# EAGLE design alphanewt_v1.7 (EAGLE 8.4.1)
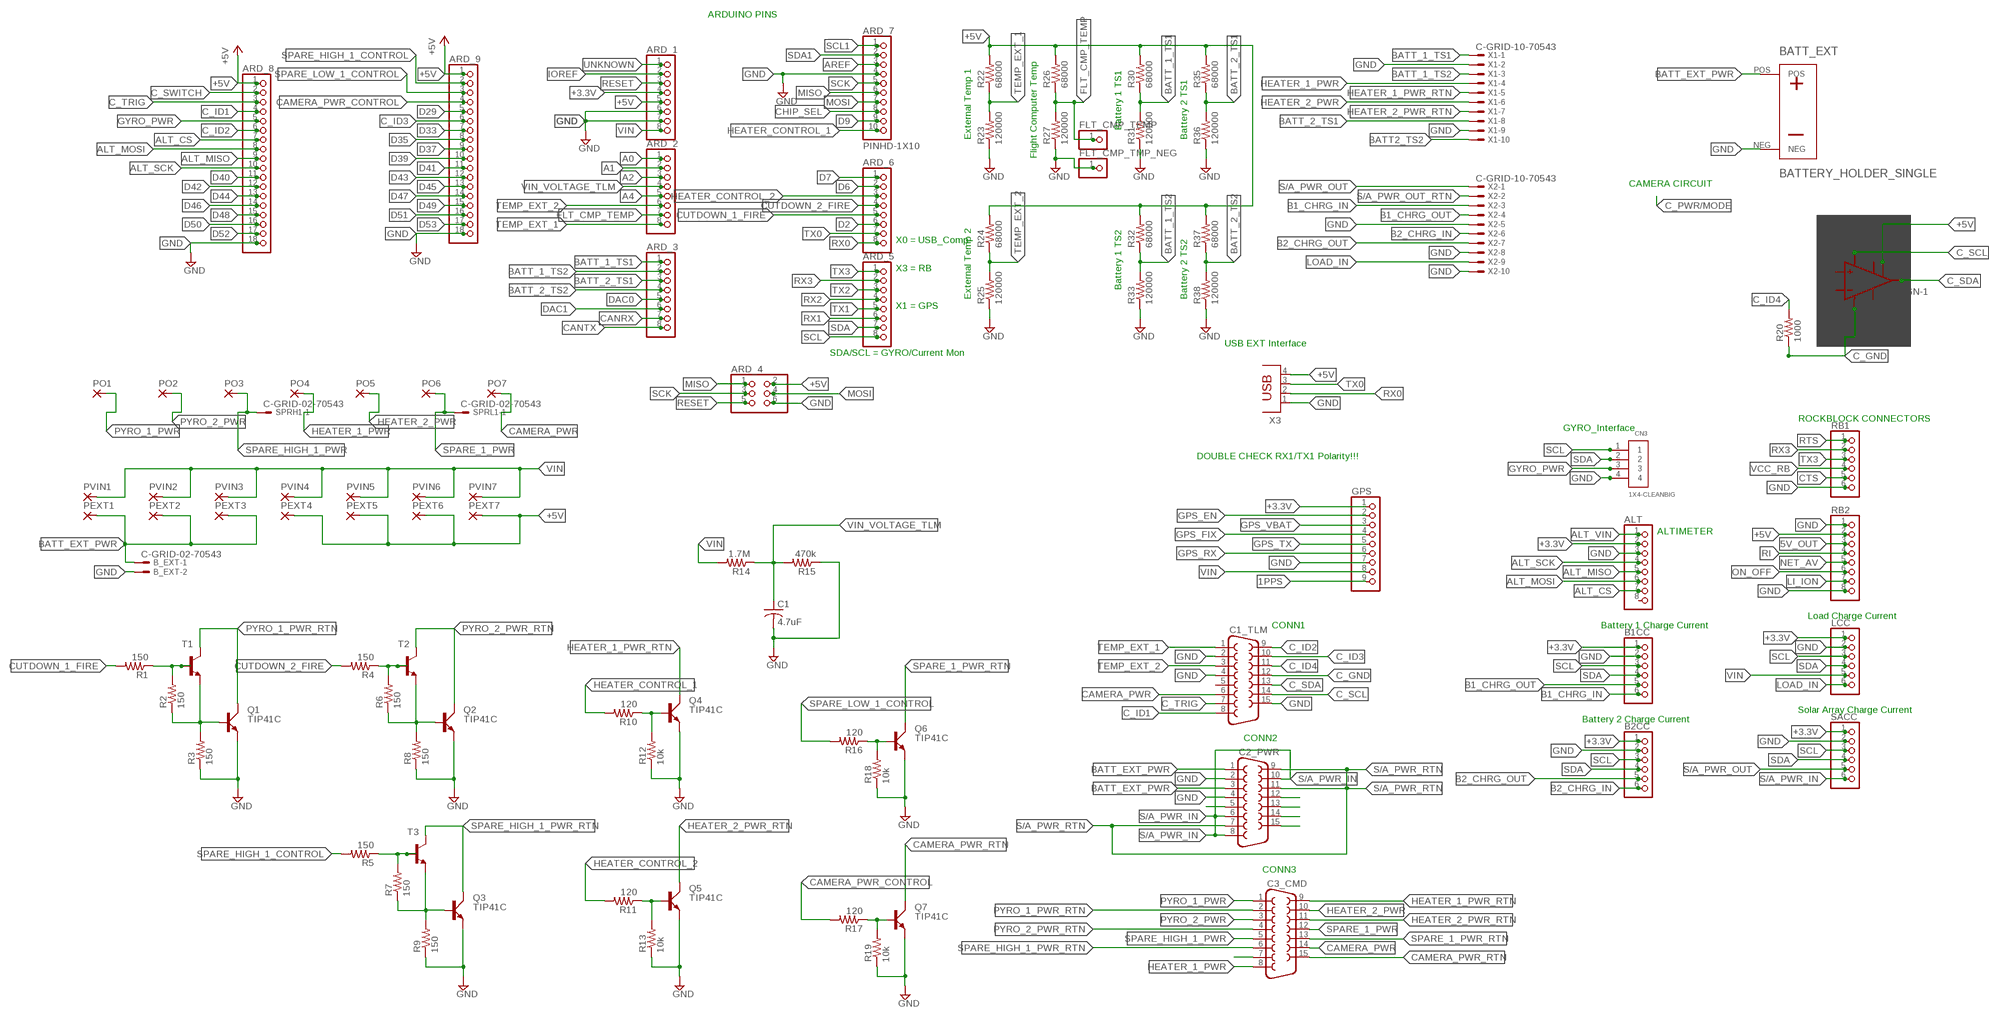
[diagram p0: schematic, sheet 1]

## Parts
ALT  PINHD-1X8BIG  [1X08-BIG]
ARD_1  PINHD-1X8BIG  [1X08-BIG]
ARD_2  PINHD-1X8BIG  [1X08-BIG]
ARD_3  PINHD-1X8BIG  [1X08-BIG]
ARD_4  PINHD-2X3  [2X03]
ARD_5  PINHD-1X8BIG  [1X08-BIG]
ARD_6  PINHD-1X8BIG  [1X08-BIG]
ARD_7  PINHD-1X10  [1X10-BIG]
ARD_8  PINHD-1X18-BIG  [1X18-BIG]
ARD_9  PINHD-1X18-BIG  [1X18-BIG]
B1CC  PINHD-1X6B  [1X06-BIG]
B2CC  PINHD-1X6B  [1X06-BIG]
B_EXT  C-GRID-02-70543  [70543-02]
BATT_EXT  BATTERY_HOLDER_SINGLE  [BATT_HOLDER_SINGLE]
C1  4.7uF  C-USC0805K  [C0805K]
C1_TLM  F15HP  [F15HP]
C2_PWR  F15HP  [F15HP]
C3_CMD  F15HP  [F15HP]
CN3  1X4-CLEANBIG  [1X04-CLEANBIG]
FLT_CMP_TEMP  PINHD-1X1  [1X01]
FLT_CMP_TMP_NEG  PINHD-1X1  [1X01]
GPS  PINHD-1X9  [1X09-BIG]
IC1  LM386N-1  [DIL08]
LCC  PINHD-1X6B  [1X06-BIG]
PEXT1  SMD2  [SMD1,27-2,54]
PEXT2  SMD2  [SMD1,27-2,54]
PEXT3  SMD2  [SMD1,27-2,54]
PEXT4  SMD2  [SMD1,27-2,54]
PEXT5  SMD2  [SMD1,27-2,54]
PEXT6  SMD2  [SMD1,27-2,54]
PEXT7  SMD2  [SMD1,27-2,54]
PO1  SMD2  [SMD1,27-2,54]
PO2  SMD2  [SMD1,27-2,54]
PO3  SMD2  [SMD1,27-2,54]
PO4  SMD2  [SMD1,27-2,54]
PO5  SMD2  [SMD1,27-2,54]
PO6  SMD2  [SMD1,27-2,54]
PO7  SMD2  [SMD1,27-2,54]
PVIN1  SMD2  [SMD1,27-2,54]
PVIN2  SMD2  [SMD1,27-2,54]
PVIN3  SMD2  [SMD1,27-2,54]
PVIN4  SMD2  [SMD1,27-2,54]
PVIN5  SMD2  [SMD1,27-2,54]
PVIN6  SMD2  [SMD1,27-2,54]
PVIN7  SMD2  [SMD1,27-2,54]
Q1  TIP41C  [TO220AV]
Q2  TIP41C  [TO220AV]
Q3  TIP41C  [TO220AV]
Q4  TIP41C  [TO220AV]
Q5  TIP41C  [TO220AV]
Q6  TIP41C  [TO220AV]
Q7  TIP41C  [TO220AV]
R1  150  R-US_R0805  [R0805]
R2  150  R-US_R0805  [R0805]
R3  150  R-US_R0805  [R0805]
R4  150  R-US_R0805  [R0805]
R5  150  R-US_R0805  [R0805]
R6  150  R-US_R0805  [R0805]
R7  150  R-US_R0805  [R0805]
R8  150  R-US_R0805  [R0805]
R9  150  R-US_R0805  [R0805]
R10  120  R-US_R0805  [R0805]
R11  120  R-US_R0805  [R0805]
R12  10k  R-US_R0805  [R0805]
R13  10k  R-US_R0805  [R0805]
R14  1.7M  R-US_R0805  [R0805]
R15  470k  R-US_R0805  [R0805]
R16  120  R-US_R0805  [R0805]
R17  120  R-US_R0805  [R0805]
R18  10k  R-US_R0805  [R0805]
R19  10k  R-US_R0805  [R0805]
R20  1000  R-US_R0805  [R0805]
R22  68000  R-US_R0805  [R0805]
R23  120000  R-US_R0805  [R0805]
R24  68000  R-US_R0805  [R0805]
R25  120000  R-US_R0805  [R0805]
R26  68000  R-US_R0805  [R0805]
R27  120000  R-US_R0805  [R0805]
R30  68000  R-US_R0805  [R0805]
R31  120000  R-US_R0805  [R0805]
R32  68000  R-US_R0805  [R0805]
R33  120000  R-US_R0805  [R0805]
R35  68000  R-US_R0805  [R0805]
R36  120000  R-US_R0805  [R0805]
R37  68000  R-US_R0805  [R0805]
R38  120000  R-US_R0805  [R0805]
RB1  PINHD-1X6CB  [1X06-CLEANBIG]
RB2  PINHD-1X8BIG  [1X08-BIG]
SACC  PINHD-1X6B  [1X06-BIG]
SPRH1  C-GRID-02-70543  [70543-02]
SPRL1  C-GRID-02-70543  [70543-02]
T1  2N3904  [TO92]
T2  2N3904  [TO92]
T3  2N3904  [TO92]
X1  C-GRID-10-70543  [70543-10]
X2  C-GRID-10-70543  [70543-10]
X3  PN87520  [PN87520]

## Nets
1PPS: GPS.9
5V_OUT: RB2.3
+3.3V: ALT.2 ARD_1.4 B1CC.1 B2CC.1 GPS.1 LCC.1 SACC.1
+5V [PWR]: ARD_1.5 ARD_4.2 ARD_8.1 ARD_9.1 IC1.8(GAIN) PEXT4.1(P) PEXT5.1(P) PEXT6.1(P) PEXT7.1(P) R22.2 R24.2 R26.2 R30.2 R32.2 R35.2 R37.2 RB2.2 X3.4
A0: ARD_2.1
A1: ARD_2.2
A2: ARD_2.3
A4: ARD_2.5
ALT_CS: ALT.7 ARD_8.7
ALT_MISO: ALT.5 ARD_8.9
ALT_MOSI: ALT.6 ARD_8.8
ALT_SCK: ALT.4 ARD_8.10
ALT_VIN: ALT.1
AREF: ARD_7.3
B1_CHRG_IN [PWR]: B1CC.6 X2.3
B1_CHRG_OUT [PWR]: B1CC.5 X2.4
B2_CHRG_IN [PWR]: B2CC.6 X2.6
B2_CHRG_OUT [PWR]: B2CC.5 X2.7
BATT2_TS2: X1.10
BATT_1_TS1: ARD_3.1 R30.1 R31.2 X1.1
BATT_1_TS2: ARD_3.2 R32.1 R33.2 X1.3
BATT_2_TS1: ARD_3.3 R35.1 R36.2 X1.8
BATT_2_TS2: ARD_3.4 R37.1 R38.2
BATT_EXT_PWR [PWR]: B_EXT.1 BATT_EXT.POS C2_PWR.1 C2_PWR.3 PEXT1.1(P) PEXT2.1(P) PEXT3.1(P)
C_GND: C1_TLM.12 IC1.4(GND) R20.1
C_ID1: ARD_8.4 C1_TLM.8
C_ID2: ARD_8.6 C1_TLM.9
C_ID3: ARD_9.6 C1_TLM.10
C_ID4: C1_TLM.11 R20.2
C_SCL: C1_TLM.14 IC1.6(VS)
C_SDA: C1_TLM.13 IC1.5(OUT)
C_SWITCH: ARD_8.2
C_TRIG: ARD_8.3 C1_TLM.7
CAMERA_PWR [PWR]: C1_TLM.6 C3_CMD.14 PO7.1(P)
CAMERA_PWR_CONTROL: ARD_9.4 R17.2
CAMERA_PWR_RTN [PWR]: C3_CMD.15 Q7.C
CANRX: ARD_3.7
CANTX: ARD_3.8
CHIP_SEL: ARD_7.8
CTS: RB1.5
CUTDOWN_1_FIRE: ARD_6.5 R1.2
CUTDOWN_2_FIRE: ARD_6.4 R4.2
D2: ARD_6.6
D6: ARD_6.2
D7: ARD_6.1
D9: ARD_7.9
D29: ARD_9.5
D33: ARD_9.7
D35: ARD_9.8
D37: ARD_9.9
D39: ARD_9.10
D40: ARD_8.11
D41: ARD_9.11
D42: ARD_8.12
D43: ARD_9.12
D44: ARD_8.13
D45: ARD_9.13
D46: ARD_8.14
D47: ARD_9.14
D48: ARD_8.15
D49: ARD_9.15
D50: ARD_8.16
D51: ARD_9.16
D52: ARD_8.17
D53: ARD_9.17
DAC0: ARD_3.5
DAC1: ARD_3.6
FLT_CMP_TEMP: ARD_2.7 FLT_CMP_TEMP.1 R26.1 R27.2
GND: ALT.3 ARD_1.6 ARD_1.7 ARD_4.6 ARD_7.4 ARD_8.18 ARD_9.18 B1CC.2 B2CC.2 B_EXT.2 BATT_EXT.NEG C1.2 C1_TLM.2 C1_TLM.4 C1_TLM.15 C2_PWR.2 C2_PWR.4 CN3.4 FLT_CMP_TMP_NEG.1 GPS.7 LCC.2 Q1.E Q2.E Q3.E Q4.E Q5.E Q6.E Q7.E R3.1 R8.1 R9.1 R12.1 R13.1 R15.1 R18.1 R19.1 R23.1 R25.1 R27.1 R31.1 R33.1 R36.1 R38.1 RB1.6 RB2.1 RB2.8 SACC.2 X1.2 X1.9 X2.5 X2.8 X2.10 X3.1
GPS_EN: GPS.2
GPS_FIX: GPS.4
GPS_RX: GPS.6
GPS_TX: GPS.5
GPS_VBAT: GPS.3
GYRO_PWR: ARD_8.5 CN3.3
HEATER_1_PWR [PWR]: C3_CMD.8 PO4.1(P) X1.4
HEATER_1_PWR_RTN [PWR]: C3_CMD.9 Q4.C X1.5
HEATER_2_PWR [PWR]: C3_CMD.10 PO5.1(P) X1.6
HEATER_2_PWR_RTN [PWR]: C3_CMD.11 Q5.C X1.7
HEATER_CONTROL_1: ARD_7.10 R10.2
HEATER_CONTROL_2: ARD_6.3 R11.2
IOREF: ARD_1.2
LI_ION: RB2.7
LOAD_IN [PWR]: LCC.6 X2.9
MISO: ARD_4.1 ARD_7.6
MOSI: ARD_4.4 ARD_7.7
N$15: R4.1 R6.2 T2.2(B)
N$16: R1.1 R2.2 T1.2(B)
N$18: Q4.B R10.1 R12.2
N$19: Q2.B R6.1 R8.2 T2.3(E)
N$22: Q5.B R11.1 R13.2
N$23: Q1.B R2.1 R3.2 T1.3(E)
N$24: Q6.B R16.1 R18.2
N$26: R5.1 R7.2 T3.2(B)
N$27: Q3.B R7.1 R9.2 T3.3(E)
N$31: Q7.B R17.1 R19.2
N$47: C2_PWR.12
N$48: C2_PWR.13
N$49: C2_PWR.14
N$50: C2_PWR.15
N$55: C2_PWR.5
N$72 [PWR]: C3_CMD.7
NET_AV: RB2.5
ON_OFF: RB2.6
PYRO_1_PWR [PWR]: C3_CMD.1 PO1.1(P)
PYRO_1_PWR_RTN [PWR]: C3_CMD.2 Q1.C T1.1(C)
PYRO_2_PWR [PWR]: C3_CMD.3 PO2.1(P)
PYRO_2_PWR_RTN [PWR]: C3_CMD.4 Q2.C T2.1(C)
RESET: ARD_1.3 ARD_4.5
RI: RB2.4
RTS: RB1.1
RX0: ARD_6.8 X3.2
RX1: ARD_5.6
RX2: ARD_5.4
RX3: ARD_5.2 RB1.2
S/A_PWR_IN [PWR]: C2_PWR.6 C2_PWR.8 C2_PWR.10 SACC.6
S/A_PWR_OUT [PWR]: SACC.5 X2.1
S/A_PWR_OUT_RTN: X2.2
S/A_PWR_RTN [PWR]: C2_PWR.7 C2_PWR.9 C2_PWR.11
SCK: ARD_4.3 ARD_7.5
SCL: ARD_5.8 B1CC.3 B2CC.3 CN3.1 LCC.3 SACC.3
SCL1: ARD_7.1
SDA: ARD_5.7 B1CC.4 B2CC.4 CN3.2 LCC.4 SACC.4
SDA1: ARD_7.2
SPARE_1_PWR [PWR]: C3_CMD.12 PO6.1(P) SPRL1.1
SPARE_1_PWR_RTN [PWR]: C3_CMD.13 Q6.C
SPARE_HIGH_1_CONTROL: ARD_9.2 R5.2
SPARE_HIGH_1_PWR [PWR]: C3_CMD.5 PO3.1(P) SPRH1.1
SPARE_HIGH_1_PWR_RTN [PWR]: C3_CMD.6 Q3.C T3.1(C)
SPARE_LOW_1_CONTROL: ARD_9.3 R16.2
TEMP_EXT_1: ARD_2.8 C1_TLM.1 R22.1 R23.2
TEMP_EXT_2: ARD_2.6 C1_TLM.3 R24.1 R25.2
TX0: ARD_6.7 X3.3
TX1: ARD_5.5
TX2: ARD_5.3
TX3: ARD_5.1 RB1.3
UNKNOWN: ARD_1.1
VCC_RB: RB1.4
VIN [PWR]: ARD_1.8 GPS.8 LCC.5 PVIN1.1(P) PVIN2.1(P) PVIN3.1(P) PVIN4.1(P) PVIN5.1(P) PVIN6.1(P) PVIN7.1(P) R14.2
VIN_VOLTAGE_TLM: ARD_2.4 C1.1 R14.1 R15.2
Unconnected: ALT.8 C1_TLM.5 IC1.1(GAIN) IC1.2(-IN) IC1.3(+IN) IC1.7(BYPASS) SPRH1.2 SPRL1.2

## Notes on the sheet
- ARDUINO PINS
- Battery 1 TS1
- External Temp 1 | Battery 2 TS1
- Flight Computer Temp
- CAMERA CIRCUIT
- X0 = USB_Comp
- X3 = RB
- Battery 1 TS2
- External Temp 2 | Battery 2 TS2
- X1 = GPS
- USB EXT Interface
- SDA/SCL = GYRO/Current Mon
- ROCKBLOCK CONNECTORS
- GYRO_Interface
- DOUBLE CHECK RX1/TX1 Polarity!!!
- ALTIMETER
- Load Charge Current
- CONN1 | Battery 1 Charge Current
- Solar Array Charge Current
- Battery 2 Charge Current
- CONN2
- CONN3

## Library data of the parts
ALT ARD_1-ARD_3 ARD_5 ARD_6 RB2 = adafruit:PINHD-1X8: PIN HEADER; OC_NEWARK: unknown
ARD_4 = pinhead:PINHD-2X3: PIN HEADER; OC_NEWARK: unknown
ARD_7 = adafruit:PINHD-1X10: Pin header 1x10 0.1" spacing With round pins; OC_NEWARK: unknown
ARD_8 ARD_9 = adafruit:PINHD-1X18: PIN HEADER; OC_NEWARK: unknown
B1CC B2CC LCC RB1 SACC = adafruit:PINHD-1X6: PIN HEADER; OC_NEWARK: unknown
B_EXT SPRH1 SPRL1 = con-molex:C-GRID-02: CONNECTOR wire to board 2.54 mm (0.100") pitch header; MF: MOLEX; MPN: 70543-0001; OC_FARNELL: unknown; OC_NEWARK: 59H2645
BATT_EXT = Battery_Holder_Single:BATTERY_HOLDER_SINGLE
C1 = adafruit:C-US: CAPACITOR, American symbol; MPN: C2012X6S1H475K125AC; OC_NEWARK: 95Y0059
C1_TLM C2_PWR C3_CMD = adafruit:F15: SUB-D HDH is also known as a 'right angle VGA' connector; MPN: 5504F1-15S-02A-03; OC_NEWARK: 18T0705
CN3 = adafruit:1X4: 4-pin connector
FLT_CMP_TEMP FLT_CMP_TMP_NEG = adafruit:PINHD-1X1: Pin header 1x1 for 0.1" spacing With round pins; OC_NEWARK: unknown
GPS = adafruit:PINHD-1X9: Pin header 1x10 0.1" spacing With round pins
IC1 = linear:LM386?-*: Low Voltage Audio Power Amplifier Source: http://cache.national.com/ds/LM/LM386.pdf
PEXT1-PEXT7 PO1-PO7 PVIN1-PVIN7 = wirepad:SMD2: SMD PAD; OC_NEWARK: unknown
Q1-Q7 = transistor-power:TIP41C: NPN TRANSISTOR; MF: FAIRCHILD SEMICONDUCTOR; MPN: TIP41C; OC_NEWARK: 58K2429
R1-R20 R22-R27 R30-R33 R35-R38 = adafruit:R-US_: RESISTOR, American symbol; MF: VISHAY/DALE; MPN: CRCW120633R2FKEA; OC_NEWARK: 42K4999
T1-T3 = transistor:2N3904: NPN TRANSISTOR; MF: NTE ELECTRONICS; MPN: 2N3904; OC_NEWARK: 33C8259
X1 X2 = con-molex:C-GRID-10: CONNECTOR wire to board 2.54 mm (0.100") pitch header; OC_FARNELL: unknown; OC_NEWARK: unknown
X3 = con-berg:PN87520: BERG USB connector; OC_FARNELL: unknown; OC_NEWARK: unknown

## Net classes
0 default: width 0.305 mm, drill 0.508 mm, clearance 0.254 mm
1 PWR: width 0.406 mm, drill 0.508 mm, clearance 0.305 mm

## Board
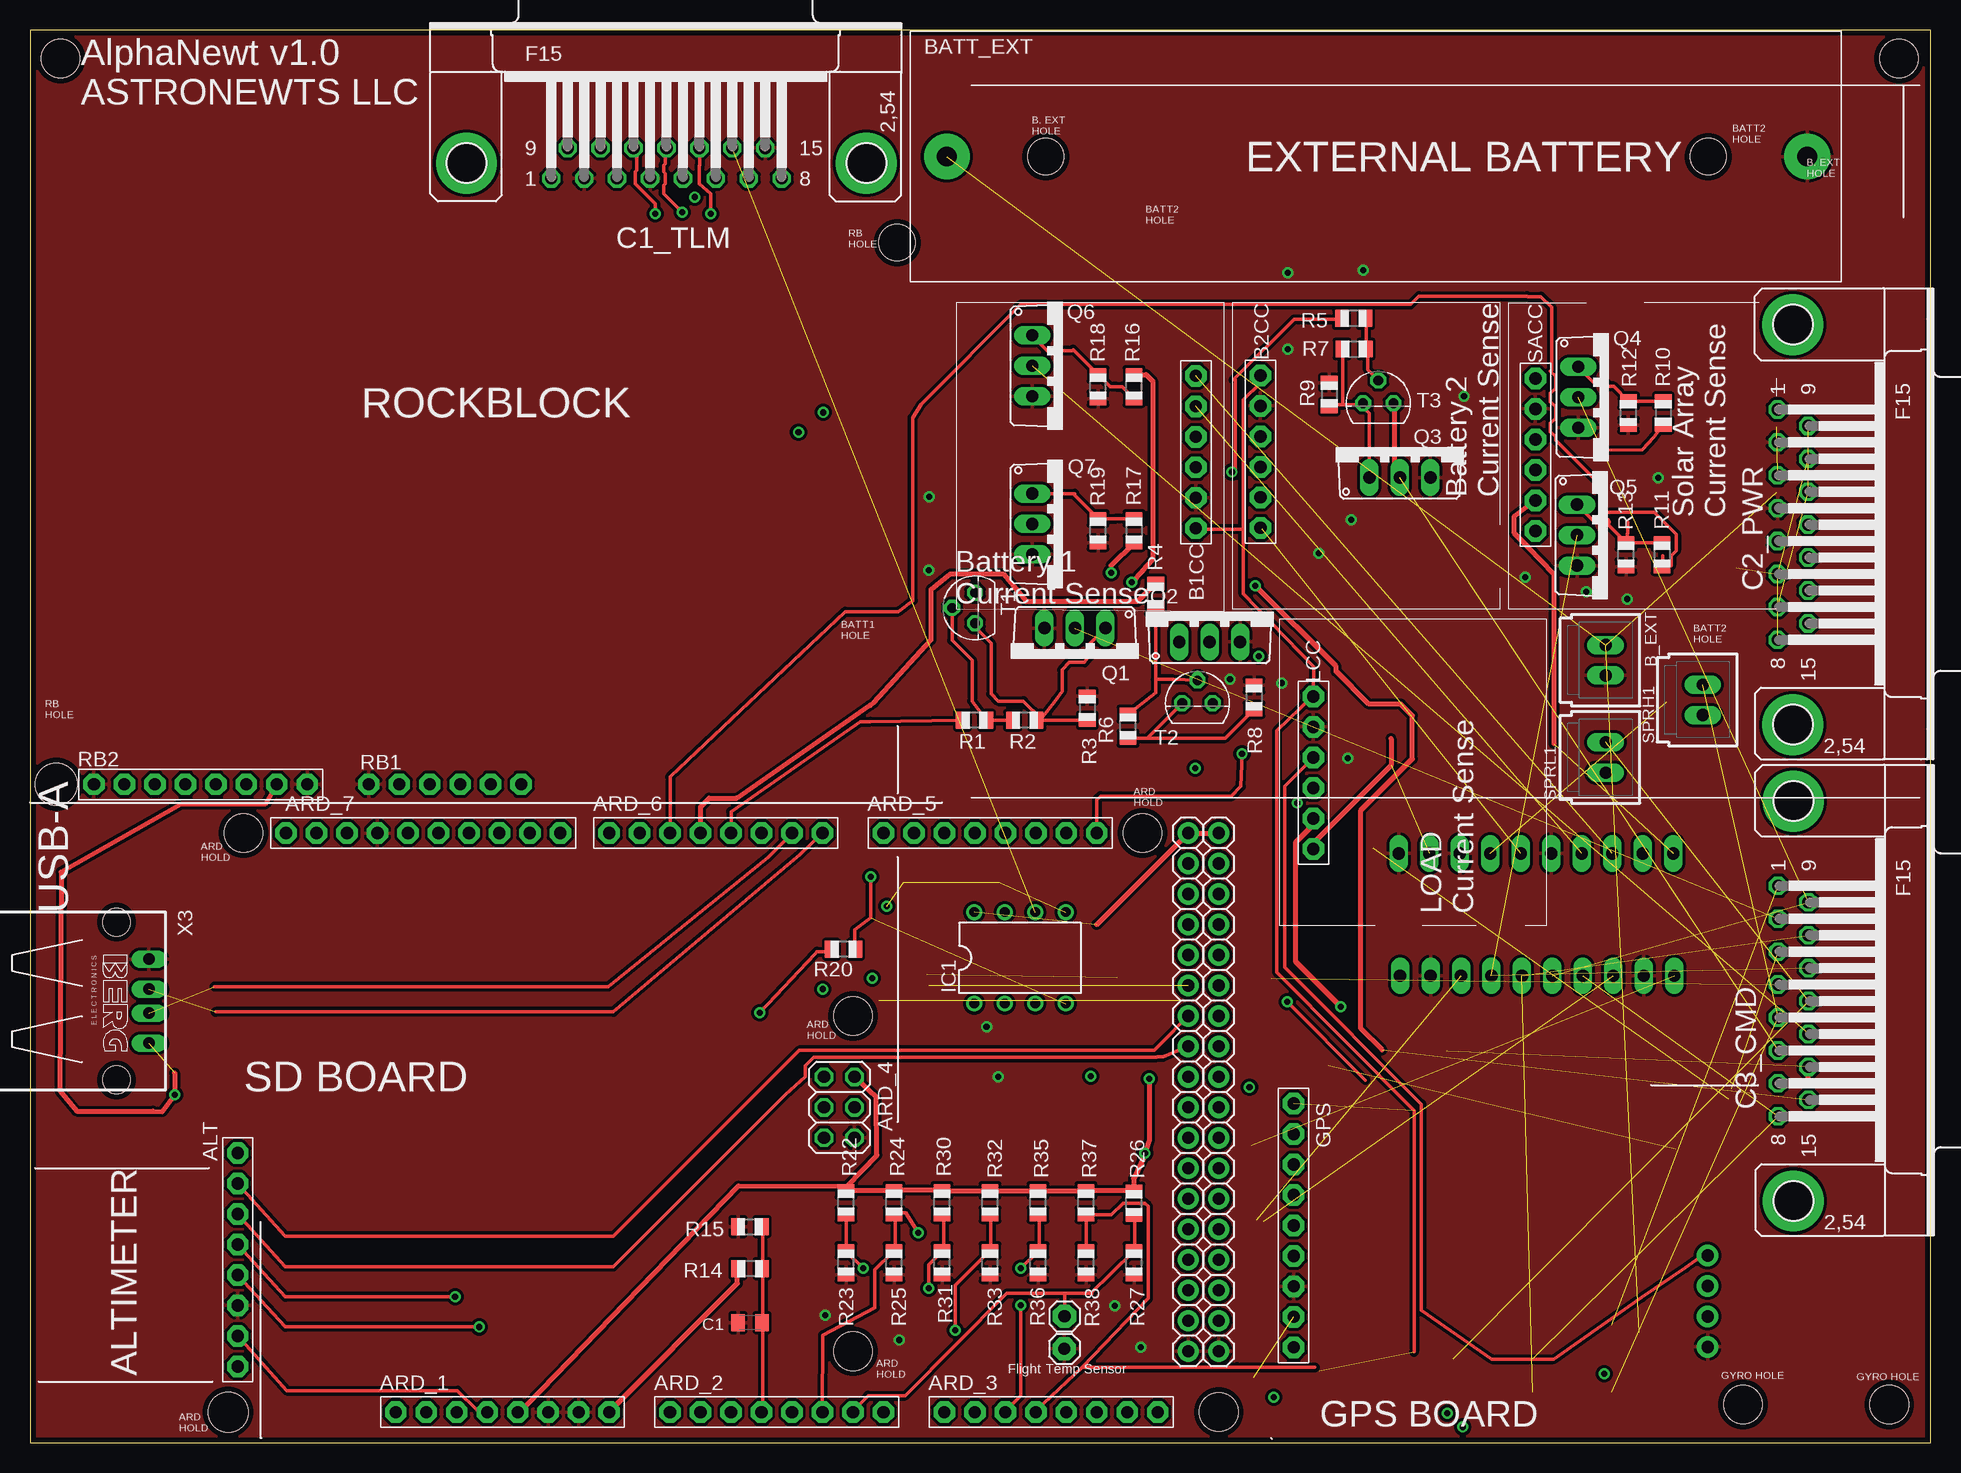
[diagram p1: board, top side]
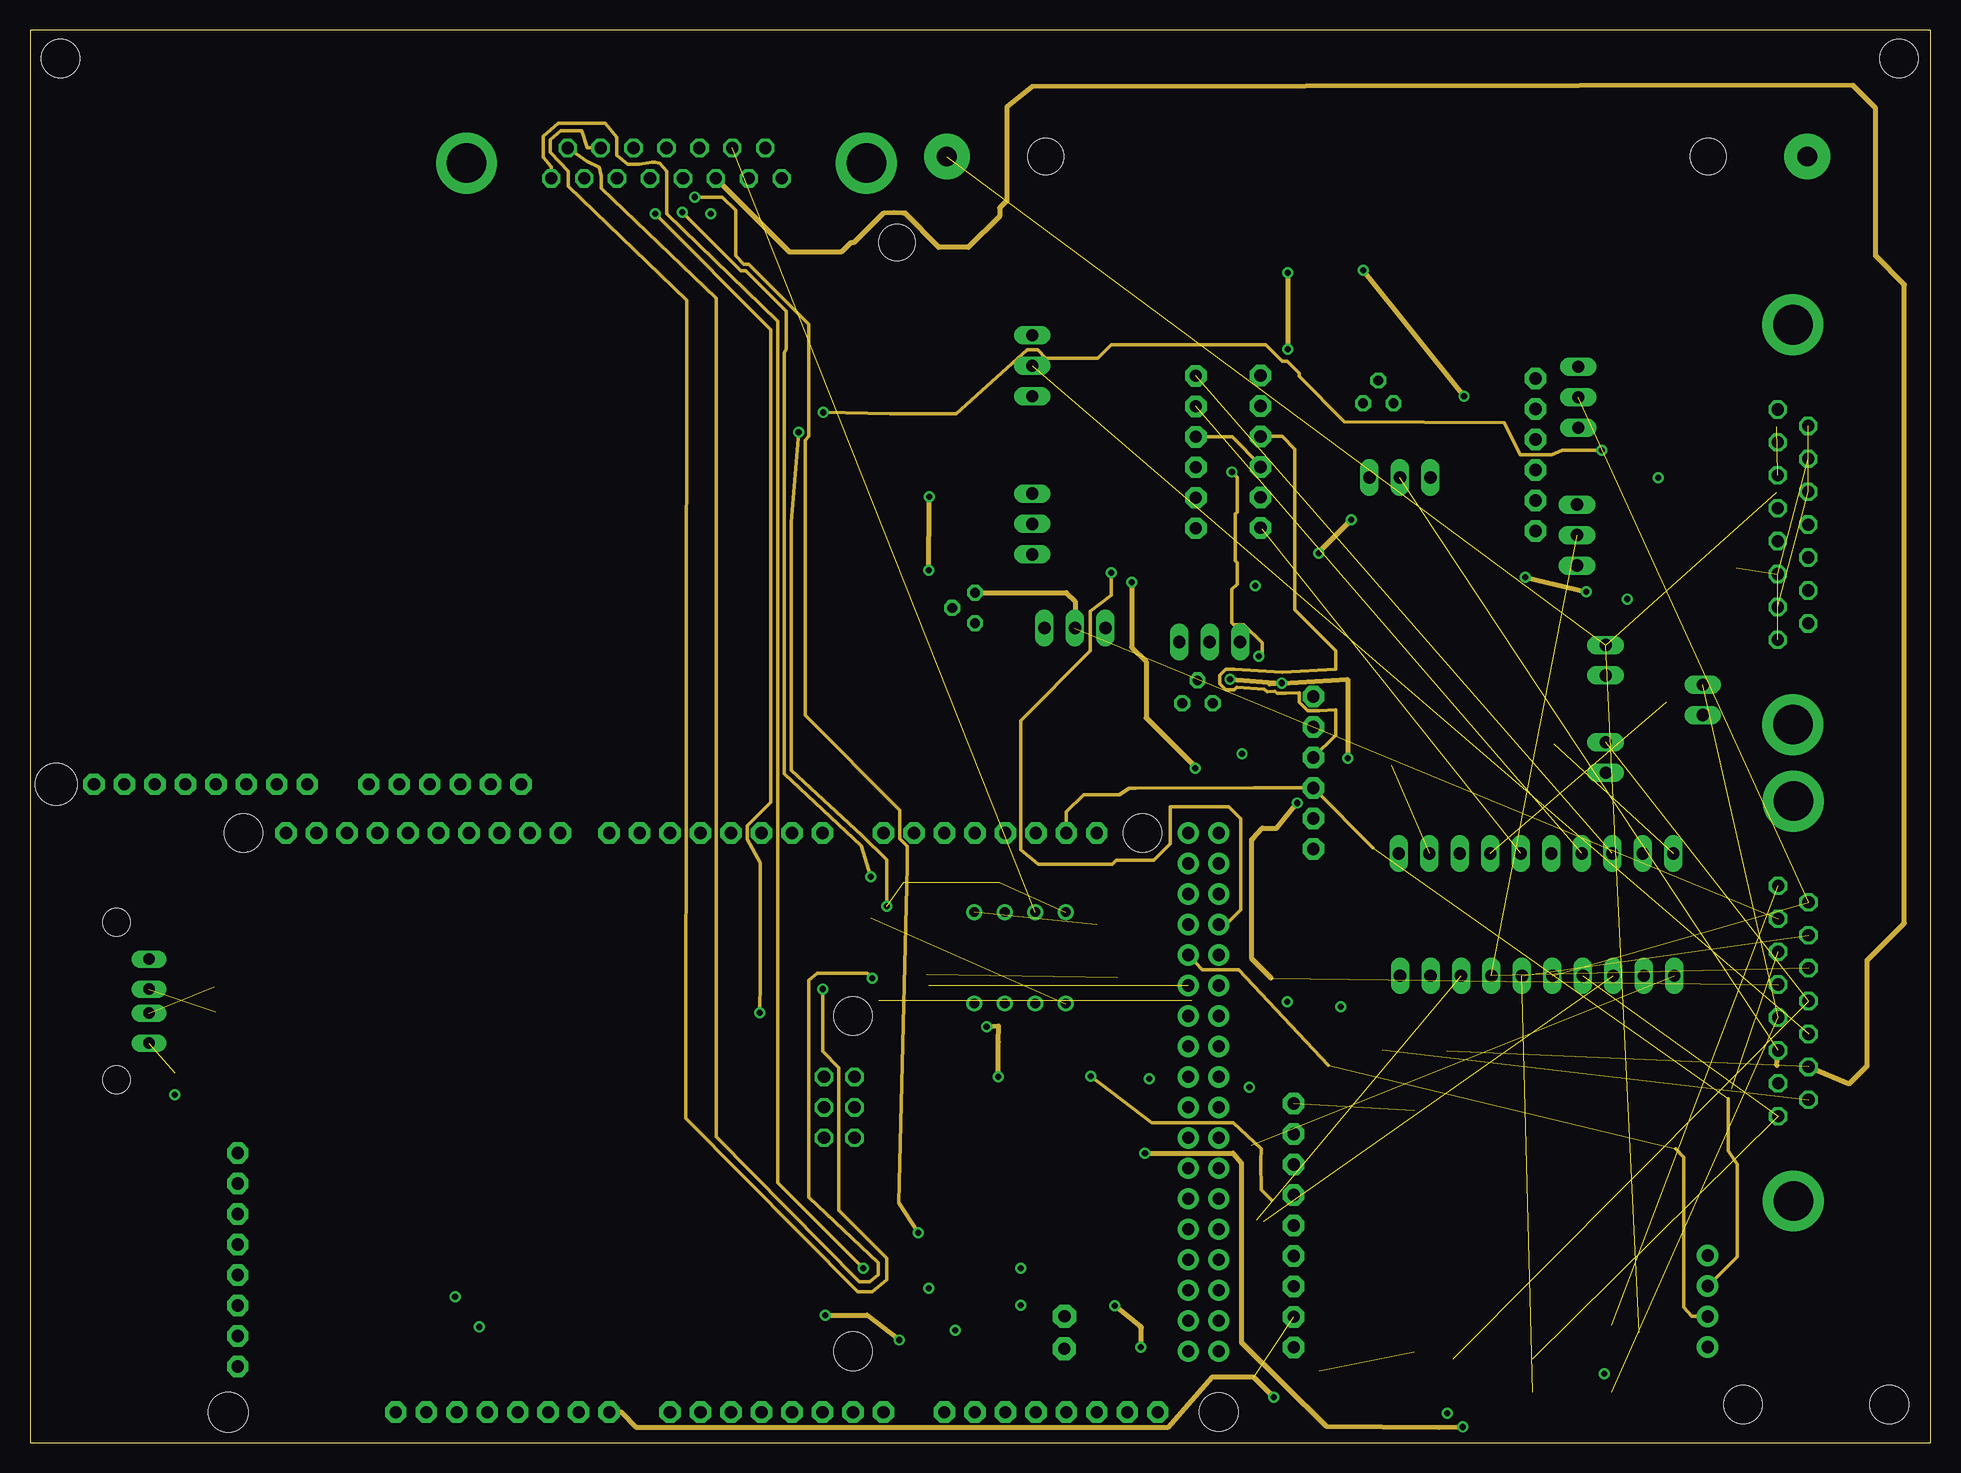
[diagram p2: board, inner layer Route2]
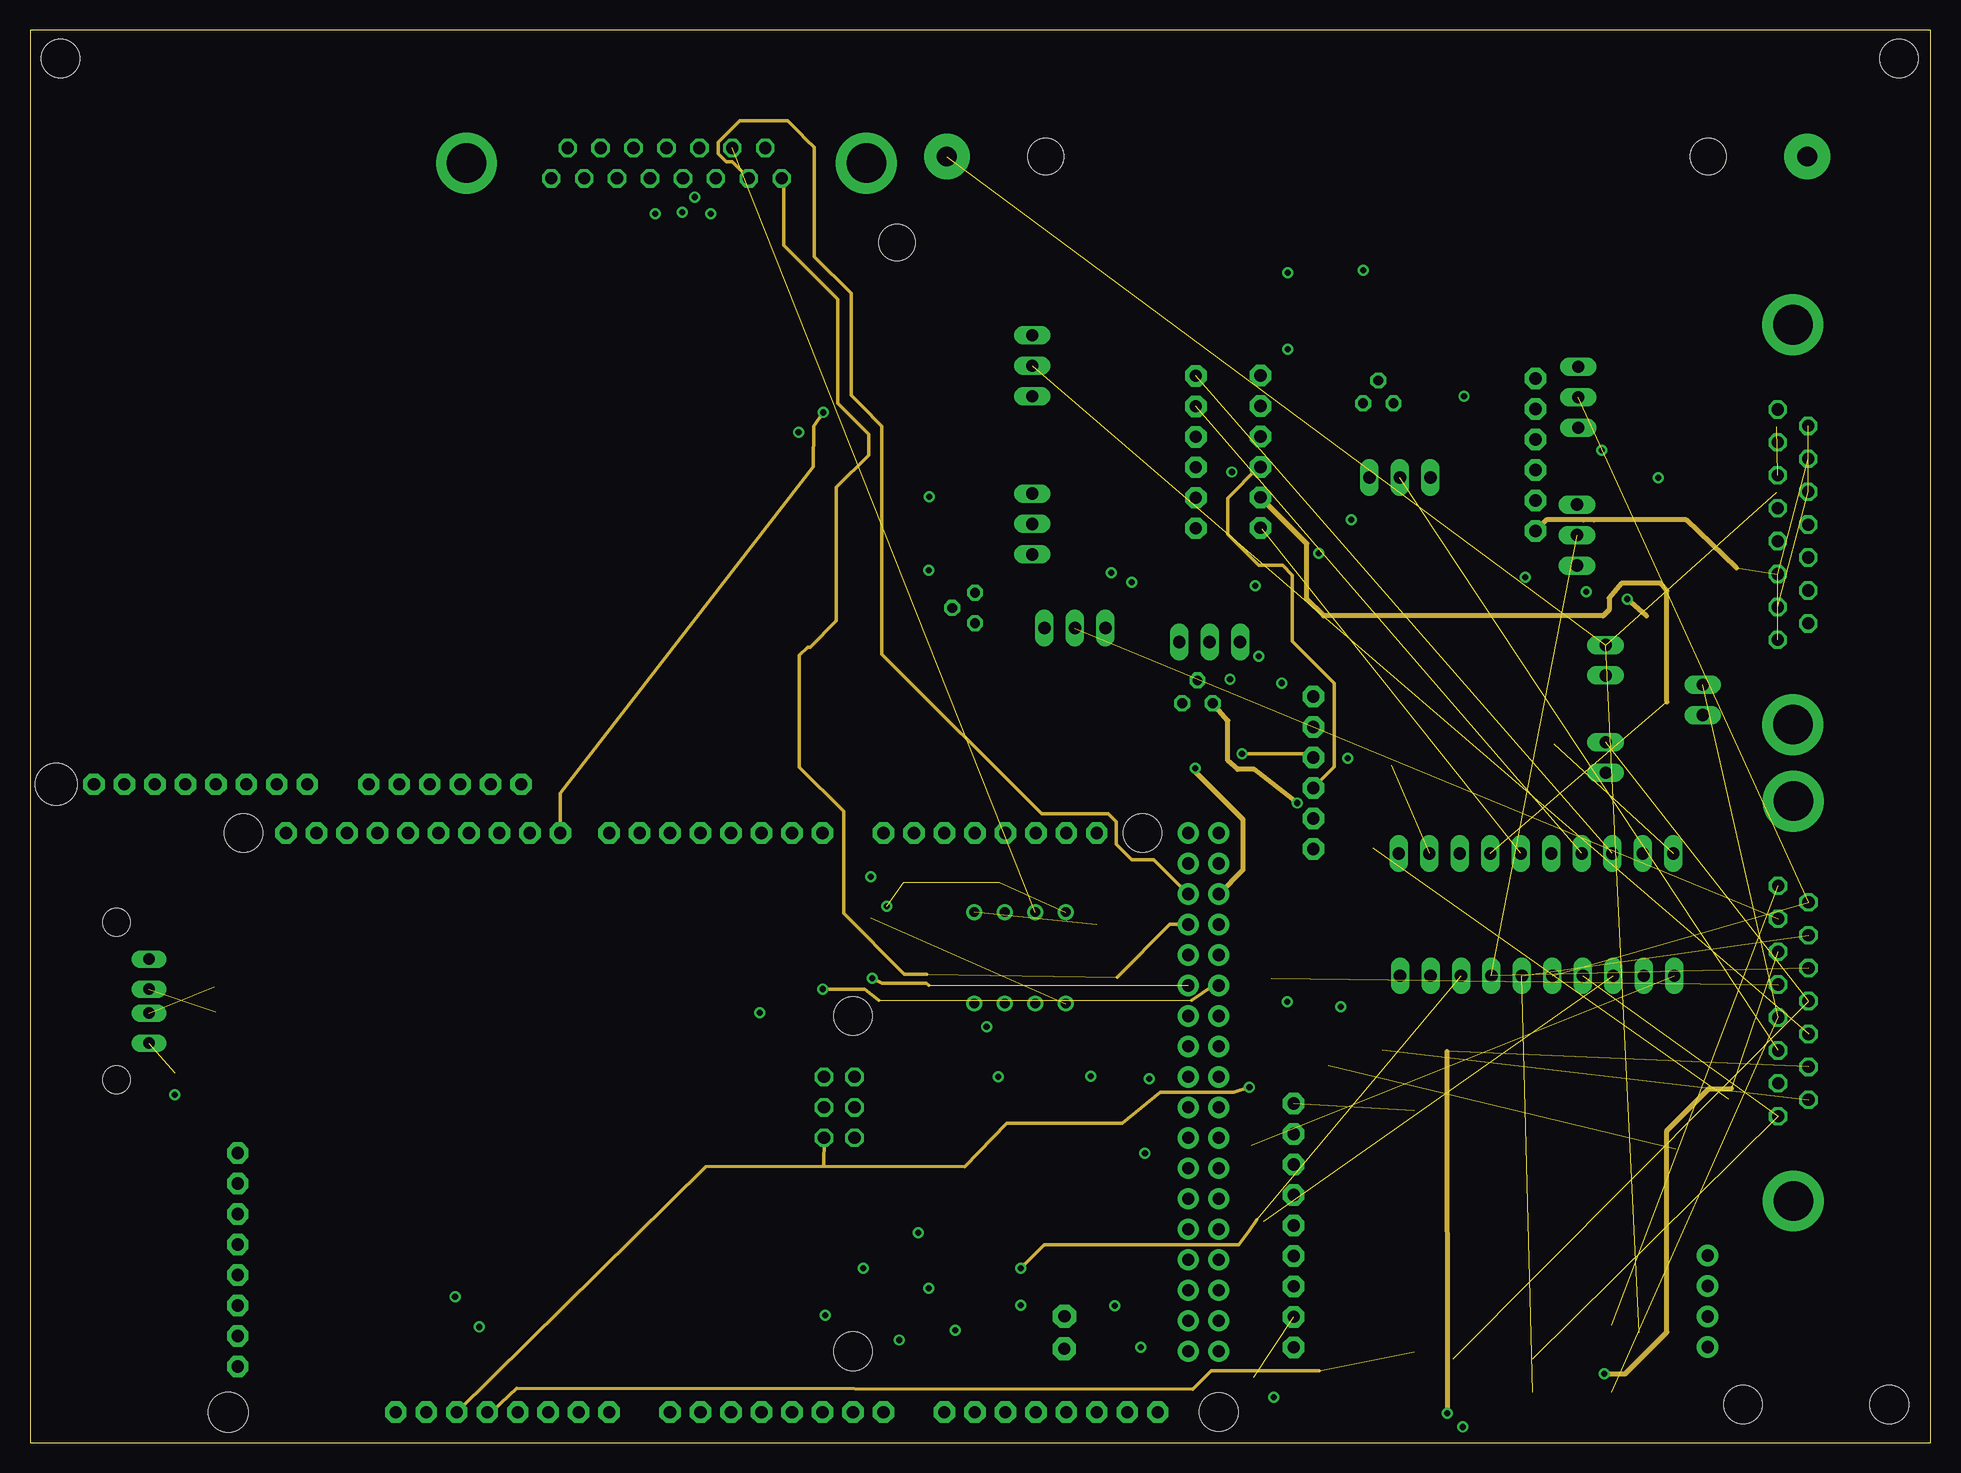
[diagram p3: board, inner layer Route15]
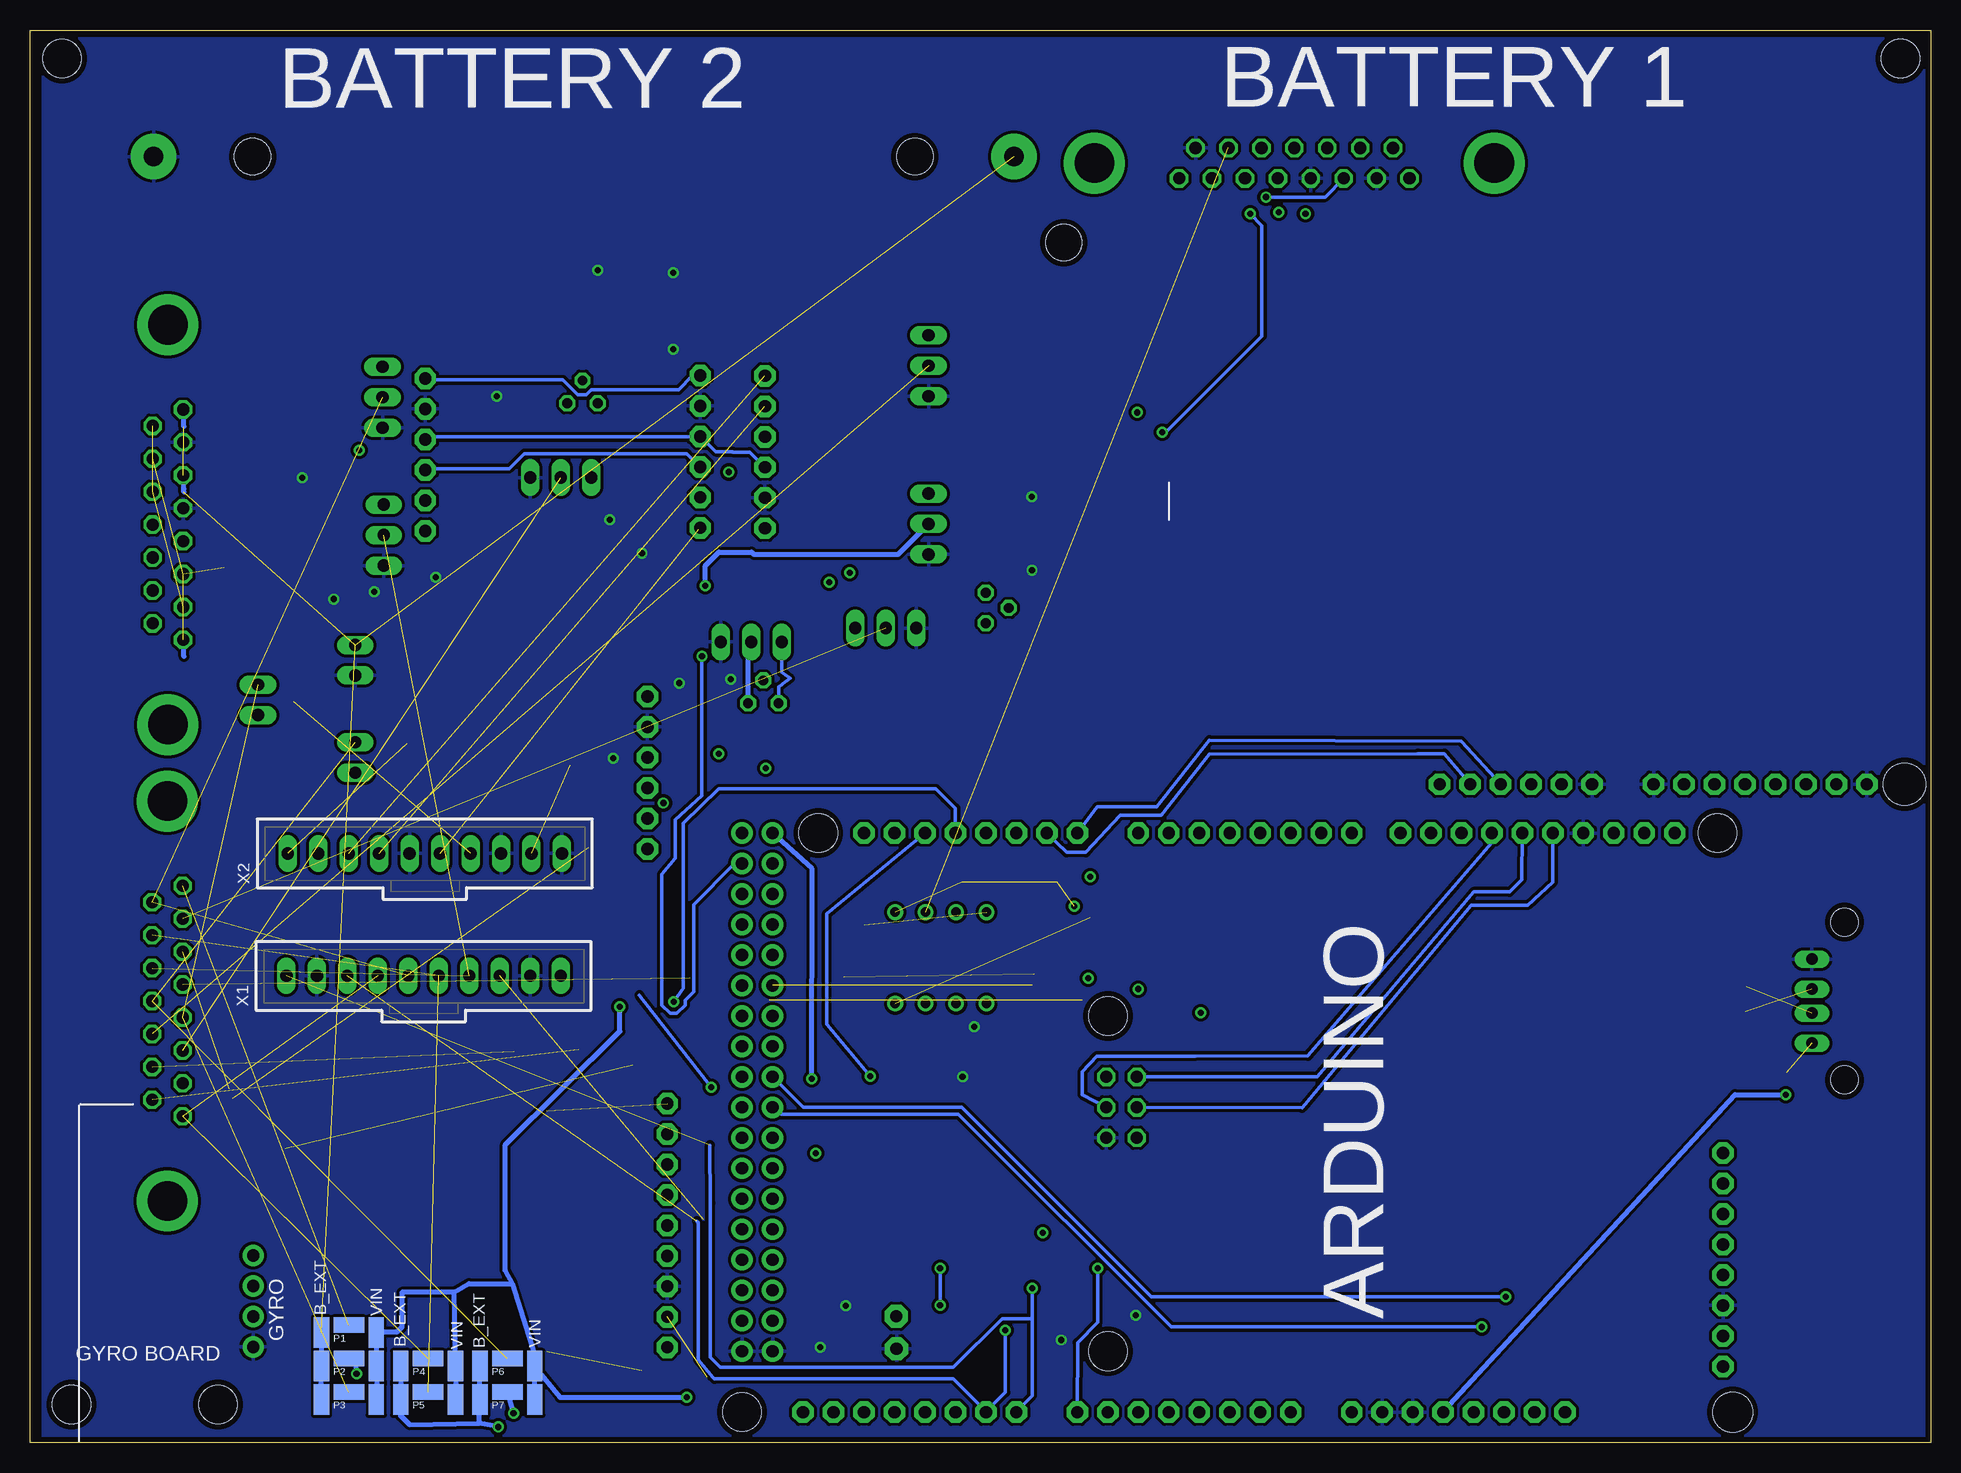
[diagram p4: board, bottom side, seen from below]

Size 158.4 x 117.72 mm. Coordinates in mm from the lower left corner, seen from the top.
Outline: 0,0 158.4,0 158.4,117.72 0,117.72 0,0
Copper layers ((1*2)+(15*16)): Top 0.035mm / dielectric 0.2mm / Route2 0.035mm / dielectric 0.2mm / Route15 0.035mm / dielectric 0.2mm / Bottom 0.035mm
Design rules "default *": minimum track width 6mil, minimum drill 0.35mm, track to track 6mil, track to pad 6mil, pad to pad 6mil, via to via 6mil, smd to smd 6mil, copper to edge 18mil, drill to drill 6mil, minimum pad ring 10mil, minimum via ring 8mil, stop-mask expansion 4mil, vias tented up to drill 0mil, thermal gap 10mil
Holes 3.2 mm at 142.75,3.17 99.06,2.54 68.58,7.62 68.58,35.56 92.71,50.8 17.78,50.8 2.54,115.33 154.94,3.17 155.74,115.33
Holes 3.3 mm at 16.51,2.54
Holes 3.5 mm at 2.18,54.86
Holes 3 mm at 72.25,100

### Footprints (pad centres in the part's own frame; a part is rotated, then mirrored left to right if it is on the bottom)
1X08-BIG = drill 1.016 pad 1.778 octagon: 1 -8.89,0; 2 -6.35,0; 3 -3.81,0; 4 -1.27,0; 5 1.27,0; 6 3.81,0; 7 6.35,0; 8 8.89,0
2X03 = drill 1.016 octagon: 1 -2.54,-1.27; 2 -2.54,1.27; 3 0,-1.27; 4 0,1.27; 5 2.54,-1.27; 6 2.54,1.27
1X10-BIG = drill 1.016 pad 1.778 octagon: 1 -11.43,0; 2 -8.89,0; 3 -6.35,0; 4 -3.81,0; 5 -1.27,0; 6 1.27,0; 7 3.81,0; 8 6.35,0; 9 8.89,0; 10 11.43,0
1X18-BIG = drill 1.016 pad 1.778: 1 -21.59,0; 2 -19.05,0; 3 -16.51,0; 4 -13.97,0; 5 -11.43,0; 6 -8.89,0; 7 -6.35,0; 8 -3.81,0; 9 -1.27,0; 10 1.27,0; 11 3.81,0; 12 6.35,0; 13 8.89,0; 14 11.43,0; 15 13.97,0; 16 16.51,0; 17 19.05,0; 18 21.59,0
1X06-BIG = drill 1.016 pad 1.778 octagon: 1 -6.35,0; 2 -3.81,0; 3 -1.27,0; 4 1.27,0; 5 3.81,0; 6 6.35,0
70543-02 = drill 1.016 long: 1 -1.27,0; 2 1.27,0
BATT_HOLDER_SINGLE = drill 1.65 pad 3.81: NEG 74.75,10.45; POS 3.05,10.45 | hole 3: 11.3,10.45; 66.5,10.45
C0805K = smd 1.1 x 1.4: 1 -1,0; 2 1,0
F15HP = drill 1.016 octagon: 1 -9.601,-1.27; 2 -6.858,-1.27; 3 -4.115,-1.27; 4 -1.372,-1.27; 5 1.372,-1.27; 6 4.115,-1.27; 7 6.858,-1.27; 8 9.601,-1.27; 9 -8.23,1.27; 10 -5.486,1.27; 11 -2.743,1.27; 12 0,1.27; 13 2.743,1.27; 14 5.486,1.27; 15 8.23,1.27 | drill 3.302 pad 5.08: G1 -16.662,0; G2 16.662,0
1X04-CLEANBIG = drill 1.016 pad 1.778: 1 -3.81,0; 2 -1.27,0; 3 1.27,0; 4 3.81,0
1X01 = drill 1.016 pad 1.93 octagon: 1 0,0
1X09-BIG = drill 1.016 pad 1.778 octagon: 1 -10.16,0; 2 -7.62,0; 3 -5.08,0; 4 -2.54,0; 5 0,0; 6 2.54,0; 7 5.08,0; 8 7.62,0; 9 10.16,0
DIL08 = drill 0.813 pad 1.27: 1 -3.81,-3.81; 2 -1.27,-3.81; 3 1.27,-3.81; 4 3.81,-3.81; 5 3.81,3.81; 6 1.27,3.81; 7 -1.27,3.81; 8 -3.81,3.81
SMD1,27-2,54 = smd 1.27 x 2.54: 1 0,0
TO220AV = drill 1.016 long: B -2.54,-2.54; C 0,-2.54; E 2.54,-2.54
R0805 = smd 1.1 x 1.4: 1 -1,0; 2 1,0
1X06-CLEANBIG = drill 1.016 pad 1.778 octagon: 1 -6.35,0; 2 -3.81,0; 3 -1.27,0; 4 1.27,0; 5 3.81,0; 6 6.35,0
TO92 = drill 0.813 octagon: 1 1.27,0; 2 0,1.905; 3 -1.27,0
70543-10 = drill 1.016 long: 1 -11.43,0; 2 -8.89,0; 3 -6.35,0; 4 -3.81,0; 5 -1.27,0; 6 1.27,0; 7 3.81,0; 8 6.35,0; 9 8.89,0; 10 11.43,0
PN87520 = drill 0.95 long: 1 -3.5,2.71; 2 -1,2.71; 3 1,2.71; 4 3.5,2.71 | hole 2.3: -6.57,0; 6.57,0

### Placement (x,y rotation side)
ALT  17.31,15.24 90 top
ARD_1  39.37,2.54 0 top
ARD_2  62.23,2.54 0 top
ARD_3  85.09,2.54 0 top
ARD_4  67.44,27.94 270 top
ARD_5  80.01,50.8 0 top
ARD_6  57.15,50.8 0 top
ARD_7  32.77,50.8 0 top
ARD_8  96.52,29.21 270 top
ARD_9  99.06,29.21 270 top
B1CC  97.16,82.55 90 top
B2CC  102.54,82.58 270 top
B_EXT  131.3,65.2 270 top
BATT_EXT  73.36,96.72 0 top
C1  60,10 180 top
C1_TLM  53.04,106.62 0 top
C2_PWR  146.91,76.5 270 top
C3_CMD  146.95,36.8 270 top
CN3  139.8,11.79 270 top
FLT_CMP_TEMP  86.21,10.53 0 top
FLT_CMP_TMP_NEG  86.19,7.82 0 top
GPS  105.3,18.1 270 top
IC1  82.5,40.4 0 top
LCC  106.95,55.83 270 top
PEXT1  134.11,9.17 0 bottom
PEXT2  134.11,6.37 0 bottom
PEXT3  134.11,3.58 0 bottom
PEXT4  127.51,6.37 0 bottom
PEXT5  127.51,3.58 180 bottom
PEXT6  120.9,6.37 0 bottom
PEXT7  120.9,3.58 0 bottom
PO1  131.83,9.8 90 bottom
PO2  131.83,7.01 270 bottom
PO3  131.83,4.21 270 bottom
PO4  125.22,7.01 270 bottom
PO5  125.22,4.21 270 bottom
PO6  118.62,7.01 270 bottom
PO7  118.62,4.21 270 bottom
PVIN1  129.54,9.17 180 bottom
PVIN2  129.54,6.37 0 bottom
PVIN3  129.54,3.58 0 bottom
PVIN4  122.94,6.37 0 bottom
PVIN5  122.94,3.58 180 bottom
PVIN6  116.33,6.37 0 bottom
PVIN7  116.33,3.58 0 bottom
Q1  87.08,65.34 180 top
Q2  98.3,69.26 0 top
Q3  114.16,82.96 0 top
Q4  131.56,87.11 270 top
Q5  131.46,75.63 270 top
Q6  86.06,89.73 270 top
Q7  86.06,76.55 270 top
R1  78.7,60.2 180 top
R2  82.9,60.2 180 top
R3  88.1,61.2 270 top
R4  93.8,70.6 90 top
R5  110.3,93.69 180 top
R6  91.5,59.7 90 top
R7  110.34,91.14 0 top
R8  102,62.1 270 top
R9  108.28,87.34 270 top
R10  136.1,85.8 270 top
R11  136,74 270 top
R12  133.2,85.8 90 top
R13  133,74 90 top
R14  60,14.5 180 top
R15  60,18 0 top
R16  92,88 90 top
R17  92,76 270 top
R18  89,88 90 top
R19  89,76 90 top
R20  67.79,41.12 180 top
R22  68,20 90 top
R23  68,15 90 top
R24  72,20 90 top
R25  72,15 90 top
R26  92,19.96 90 top
R27  92,15 90 top
R30  76,20 90 top
R31  76,15 90 top
R32  80,20 90 top
R33  80,15 90 top
R35  84,20 90 top
R36  84,15 90 top
R37  88,20 90 top
R38  88,15 90 top
RB1  34.58,54.86 180 top
RB2  14.22,54.86 180 top
SACC  125.46,82.33 270 top
SPRH1  139.4,61.9 270 top
SPRL1  131.3,57.1 270 top
T1  78.75,69.56 90 top
T2  97.29,61.61 0 top
T3  112.36,86.61 0 top
X1  125.6,38.9 0 bottom
X2  125.5,49.1 0 bottom
X3  7.2,36.8 270 top

### Tracks (layer width: path | path; a pad name or v marks a point on that pad's centre or on a via)
+3.3V  (2 unrouted)
  Top 0.305: ARD_1.4 38,2.65 37.3,2.65 35.62,4.33 21.39,4.33 ALT.2 | 115.35,7.57 115.35,27.67 103.92,39.21 103.92,59.31 106.87,62.17 LCC.1 106.97,64.65 101.12,70.73 101.12,76.14 | 101.12,76.14 101.12,86.89 102.54,88.29 102.54,88.85 B2CC.1 | 101.12,76.14 97.23,76.14 B1CC.1
  Route15 0.305: 107.43,6.01 98.45,6.01 96.89,4.45 40.57,4.55 38.58,2.65 38.14,2.65 ARD_1.4
  Bottom 0.305: B2CC.1 102.68,88.85 103.24,88.85 104.36,87.73 111.62,87.73 112.04,87.31 112.74,87.31 114,88.57 125.45,88.57 SACC.1 | 106.87,62.31 LCC.1
+5V  (via drill 0.51)  (2 unrouted)
  Top 0.406: RB2.2 19.6,53.21 12.62,53.21 2.58,47.54 2.48,29.32 3.88,27.62 10.26,27.62 11.04,27.59 v12.07,28.99 12.04,30.82 | ARD_9.1 ARD_8.1 88.88,43.16 | 68.04,21.36 70.57,23.96 70.5,28.8 ARD_4.2 | v93.27,30.34 93.27,25.09 92.94,24.02 | 92.94,24.02 91.96,22 91.96,21.3 91.96,21 | v92.91,24.13 92.9,24.03 92.94,24.02 | 68.04,21.36 59.05,21.39 41.43,3.15 ARD_1.5 | 91.96,21 R37.2 R35.2 R32.2 R30.2 75.94,21.05 72.48,21.05 R24.2 72.05,21 68.03,21 R22.2 68.34,20.96 68.04,21.36 | 91.96,21 R26.2
  Route2 0.406: v92.91,24.13 100.24,24.13 100.94,23.29 100.94,8.36 108.03,1.38 117.4,1.28 v119.39,1.3 119.44,1.54
  Bottom 0.406: ARD_8.1 93.22,47.82 93.22,47.05 v93.27,30.34 | v12.07,28.99 16.3,28.99 40.61,2.55 ARD_1.5 | PEXT6.1 PEXT7.1 120.98,1.6 | v119.39,1.3 120.98,1.6 | 120.98,1.6 126.77,1.5 127.51,2.23 PEXT5.1 PEXT4.1
ALT_CS
  Top 0.305: ALT.7 21.29,17.18 48.62,17.18 64.12,32.69 93.67,32.69 94.23,33.25 ARD_8.7
ALT_MISO  (via drill 0.51)
  Top 0.305: v35.42,12.15 21.29,12.15 ALT.5
  Bottom 0.305: v35.42,12.15 64.96,12.15 80.75,27.94 93.95,27.94 94.54,28.52 ARD_8.9
ALT_MOSI
  Top 0.305: ALT.6 21.29,14.67 48.62,14.67 62.94,29 64.6,30.5 64.6,31.4 65.3,32.1 85.74,32.13 93.91,32.13 93.92,32.14 94.42,32.14 ARD_8.8
ALT_SCK  (via drill 0.51)
  Top 0.305: v37.43,9.64 21.29,9.64 ALT.4
  Bottom 0.305: v37.43,9.64 63.28,9.64 81.03,27.38 95.81,27.38 ARD_8.10
B1_CHRG_IN  (1 unrouted)
B1_CHRG_OUT  (1 unrouted)
B2_CHRG_IN  (1 unrouted)
  Top 0.406: 102.68,76.14 B2CC.6
B2_CHRG_OUT  (1 unrouted)
  Route15 0.406: 136.41,61.74 136.41,70.98 135.88,71.61 132.61,71.61 131.6,70.4 131.6,69.4 131.1,68.9 107.8,68.9 106.4,70.3 106.4,74.91 B2CC.5
BATT_1_TS1  (via drill 0.51)  (1 unrouted)
  Top 0.305: R30.1 76.14,19 76.14,16.07 R31.2 76,15.93 74.88,14.81 v74.88,12.85
  Bottom 0.305: 74.88,10.34 74.88,3.91 76.14,2.65 ARD_3.1 | 74.88,10.34 v74.88,12.85 | 101.75,24.8 101.7,19.98 101.7,7.12 100.86,6.29 81.44,6.29 77.39,10.34 74.88,10.34
BATT_1_TS2  (via drill 0.51)  (1 unrouted)
  Top 0.305: R32.1 80.05,19 80.05,16.07 R33.2 79.91,15.93 77.11,13.13 v77.11,9.36
  Bottom 0.305: v77.11,9.36 77.11,4.19 78.65,2.65 ARD_3.2 78.79,2.65 81.44,5.31 101.36,5.31 101.51,5.46 102.09,6.17 102.73,6.91 102.73,18.36 102.82,18.45
BATT_2_TS1  (via drill 0.51)  (1 unrouted)
  Top 0.305: R35.1 84.1,19 84.1,16.07 R36.2 83.96,15.93 v82.56,14.53 | v82.56,11.46 82.56,3.91 81.31,2.65 ARD_3.3
  Route15 0.305: 102.23,18.58 101.6,17.67 100.72,16.48 84.52,16.48 v82.56,14.53
  Bottom 0.305: v82.56,11.46 v82.56,14.53
BATT_2_TS2
  Top 0.305: R38.2 88.01,16.07 R37.1 88.15,19 90.11,19 91.08,19.95 92.9,19.95 93.18,19.7 93.18,12.01 87.7,6.29 | 87.7,6.29 83.82,2.65 ARD_3.4 | 107.07,6.27 102.63,6.27 100.58,6.29 87.7,6.29
BATT_EXT_PWR  (4 unrouted)
  Bottom 0.406: 145.57,79.21 C2_PWR.3 145.57,79.49 | 145.57,84.66 C2_PWR.1 | PEXT3.1 PEXT2.1 PEXT1.1
C_GND  (via drill 0.51)  (1 unrouted)
  Top 0.305: 68.87,41.21 R20.1 68.73,41.21 68.73,42.75 70.05,43.73 v70.05,47.16 | v54.34,102.54 52.81,104.08 52.81,104.78 52.95,104.92 52.95,105.75 52.81,105.89 52.81,106.45 52.95,106.59 52.95,107.85 C1_TLM.12
  Route2 0.305: v54.34,102.54 59.23,97.65 59.65,97.65 63.01,94.3 63.01,91.14 62.87,90.81 62.87,55.74 69.25,49.75 v70.05,47.16
C_ID1  (1 unrouted)
  Route15 0.305: ARD_8.4 94.98,43.18 90.6,38.8 | 74.72,39.03 72.87,39.03 67.8,44.1 67.8,52.6 64.1,56.3 64.1,65.6 64.8,66.3 65,66.3 67.2,68.5 67.2,79.62 69.88,82.3 69.88,84.05 67.3,86.62 67.3,95.3 62.8,99.8 62.8,105.19 C1_TLM.8
C_ID2  (via drill 0.51)  (1 unrouted)
  Route2 0.305: C1_TLM.9 46.41,106.8 47.45,106.3 47.62,105.53 47.62,104.54 57.18,95.38 57.18,25.5 69.08,13.39 69.98,13.39 70.67,13.98 70.67,14.98 64.9,20.45 64.9,38.52 65.59,39.12 65.99,39.11 68.59,39.12 69.78,39.12 v70.2,38.7
  Route15 0.305: 74.9,38.1 74.7,38.3 71,38.3 v70.2,38.7
C_ID3  (via drill 0.51)  (1 unrouted)
  Route2 0.305: v66.06,37.8 66.06,32.61 67.41,31.25 67.41,19.35 71.38,15.39 71.38,13.57 70.19,12.58 68.97,12.58 54.64,27.02 54.74,95.18 44.84,104.68 44.84,105.95 43.37,107.52 43.37,108.57 44.24,109.34 45.98,109.34 46.43,107.89 C1_TLM.10
  Route15 0.305: ARD_9.6 98.64,38.1 96.79,36.86 | 70.72,36.86 69.58,37.8 v66.06,37.8
C_ID4  (via drill 0.51)
  Top 0.305: v60.83,35.84 65.43,40.76 65.58,40.91 66.84,40.91 66.78,41.07 66.78,41.21 R20.2 | v52.11,102.4 52.11,103.24 50.43,104.92 50.43,105.89 50.57,106.03 50.57,107.71 50.43,107.85 C1_TLM.11
  Route2 0.305: v60.83,35.84 60.85,38.56 60.85,48.34 59.79,50.29 59.79,51.41 61.75,53.37 61.75,92.76 v52.11,102.4
C_SCL  (1 unrouted)
C_SDA  (via drill 0.51)  (3 unrouted)
  Top 0.305: v56.72,102.4 56.72,104.08 55.78,104.92 55.78,106.35 55.82,106.49 55.82,107.71 55.88,107.85 C1_TLM.13
  Route2 0.305: v71.39,44.7 71.41,48.58 69.31,50.63 63.42,56.02 63.42,76.69 v64.04,84.21
  Bottom 0.305: v64.04,84.21 63.84,84.1 55.74,92.2 55.74,101.42 v56.72,102.4
C_TRIG
  Route15 0.305: C1_TLM.7 58.52,106.72 58.04,106.72 57.36,107.41 57.36,108.38 59.14,110.16 63.13,110.16 63.69,109.6 64.1,109.2 64.7,108.59 65.36,107.93 65.36,98.83 68.42,95.77 68.42,87.28 69.3,86.4 69.3,86.39 71,84.69 71,65.7 84.3,52.4 89.84,52.4 90.5,51.74 90.5,49.88 91.8,48.59 93.65,48.59 ARD_8.3
CAMERA_PWR  (via drill 0.51)  (1 unrouted)
  Top 0.406: 148.19,29.9 C3_CMD.14
  Route2 0.406: C3_CMD.14 151.62,29.93 153.1,31.4 153.1,40.2 156.2,43.3 156.2,96.5 153.8,98.9 153.8,111.2 151.9,113.1 83.5,113 81.4,111.3 81.4,103.49 80.81,102.89 80.81,102.2 78.2,99.6 75.71,99.6 72.95,102.46 72.74,102.46 72,102.5 71.1,102.45 68.67,100.01 68.41,100.01 67.6,99.2 63.31,99.2 C1_TLM.6
  Route15 0.406: 118.07,32.6 v118.11,2.47
  Bottom 0.406: v118.11,2.47 118.61,4.19 PO7.1
CAMERA_PWR_CONTROL  (via drill 0.51)
  Top 0.305: R17.2 92.06,74.88 | v90.1,72.5 90.1,73.1
  Top 0.406: 90.1,73.1 R17.2
  Route2 0.305: 99.68,43.18 100.9,44.4 100.9,52 99.9,53 95,53 95,49.89 93.65,48.54 90.54,48.54 90.2,48.2 84,48.2 82.55,49.4 82.55,60.18 88.34,65.97 88.34,69.3 90.1,70.6 v90.1,72.5
  Route2 0.406: ARD_9.4 99.68,43.18
CAMERA_PWR_RTN  (via drill 0.51)  (1 unrouted)
  Top 0.406: 112.67,32.73 110.9,34.5 110.9,52.68 115.2,56.98 115.2,60.58 114.25,61.54 111.58,61.54 108.84,64.28 108.84,64.69 v102.11,71.41
  Bottom 0.406: v102.11,71.41 102.11,73.08 101,74.2 98.26,74.2 98.08,74.03 86.06,74.03 84.81,75.28 84.79,75.28 Q7.C
CUTDOWN_1_FIRE
  Top 0.305: R1.2 70.04,60.08 69.2,60.08 58.42,52.59 ARD_6.5
CUTDOWN_2_FIRE
  Top 0.406: ARD_6.4 55.88,52.98 56.6,53.7 58.88,53.7 69.97,61.43 69.98,61.42 70.05,61.48 70.32,61.67 75.1,66.9 75.1,71.1 76.7,72.4 81.1,72.4 83,70.1 92.3,70.1 R4.2
FLT_CMP_TEMP
  Top 0.305: R26.1 92.06,18.86 92.06,16.07 R27.2 91.92,15.93 88.4,12.44 86.22,12.44 | 86.22,12.44 81.42,12.44 72.92,3.91 69.85,3.91 68.59,2.65 ARD_2.7 | FLT_CMP_TEMP.1 86.22,12.44
  Top 0.406: FLT_CMP_TEMP.1 | 88.4,12.44 88.42,12.45
GND  (via drill 0.51)
  Route2 0.406: 92.56,9.6 v92.56,7.96 | v74.9,72.7 74.93,78.32 v74.93,78.81 | v104.8,97.5 v104.8,91.1 104.9,91 | v119.5,87.2 v111.1,97.7 | v124.6,72.1 v129.7,70.9 | v100,63.6 v104.3,63.3 | v104.3,63.3 103.3,63.2 | v104.3,63.3 109.8,63.6 v109.8,57.02 | v107.4,74.1 107.4,74.2 v110.1,76.9 | v72.45,8.55 69.75,10.62 v66.26,10.62 | 92.61,9.6 v90.41,11.4 | v80.69,30.48 80.7,33.38 80.72,34.73 v79.71,34.66
  Route15 0.406: 134.7,68.9 v133.1,70.3
  other vias: 135.7,80.4
  pour Top: 0.5,117.6 0.5,0.3 158.3,0.3 158.3,117.6
  pour Bottom: 0.5,0.3 157.3,0.3 157.3,117 0.5,117
GYRO_PWR  (1 unrouted)
  Route2 0.305: 108.18,31.43 100.72,39.4 97.69,39.4 ARD_8.5 | 137.13,24.49 137.79,23.77 137.79,11.28 138.48,10.52 CN3.3
HEATER_1_PWR  (2 unrouted)
HEATER_1_PWR_RTN  (2 unrouted)
HEATER_2_PWR  (2 unrouted)
HEATER_2_PWR_RTN  (2 unrouted)
HEATER_CONTROL_1  (via drill 0.51)
  Top 0.305: v130.97,82.7 134.37,82.74 135.31,83.8 136.07,84.8 R10.2
  Route2 0.305: v66.11,85.85 71.69,85.73 77.19,85.75 83.12,91.08 83.96,91.08 84.66,90.39 88.99,90.39 90.11,91.5 102.96,91.5 104.36,90.11 104.78,90.11 105.75,89.13 105.75,88.85 109.53,85.08 122.85,84.98 124.19,82.34 126.81,82.34 127.67,82.7 v130.97,82.7
  Route15 0.305: ARD_7.10 44.2,54.1 65.27,81.31 65.31,84.71 v66.11,85.85
HEATER_CONTROL_2
  Top 0.305: 136.07,73.9 R11.2 136.07,73.06 136.77,73.06 136.77,73.9 137.19,74.32 137.19,75.72 135.37,77.53 130.9,77.53 130.9,79.77 127.13,83.54 127.13,83.82 126.71,84.24 126.71,84.94 127.13,85.36 127.13,86.33 126.71,86.75 126.71,87.45 127.13,87.87 127.13,88.85 126.71,89.27 126.8,89.36 126.8,94.6 125.9,95.5 124.8,95.5 124.75,95.55 115.74,95.55 115.06,94.86 82.56,94.86 74.25,86.53 73.55,85.42 73.57,70.16 72.34,69.25 67.95,69.26 53.35,55.49 ARD_6.3
LOAD_IN  (1 unrouted)
  Top 0.406: 113.44,58.67 113.44,56.44 107.01,50.01 107.01,49.59 LCC.6
MISO
  Bottom 0.305: ARD_7.6 34.1,46.9 35.1,45.9 38.1,45.9 51.14,30.48 ARD_4.1
MOSI
  Bottom 0.305: ARD_7.7 36.59,50 51.9,32.24 61.3,32.2 69.5,32.2 70.7,30.9 70.7,29 ARD_4.4
N$15
  Top 0.305: 93.81,63.6 93.81,65.08 R4.1 | 93.81,63.6 93.81,62.51 R6.2 | 93.81,63.6 95.28,63.6 T2.2
N$16
  Top 0.305: R2.2 81.95,60.1 81.45,60.2 R1.1 78.5,61.8 78.5,65.2 76.85,66.85 T1.2
N$18
  Top 0.305: R10.1 R12.2 131.97,88.03 131.84,88.03 131.55,88.02 131.29,88.38 130.29,88.38 Q4.B
N$19
  Top 0.305: R6.1 93.1,58.7 | 93.1,58.7 T2.3 | 93.1,58.7 99.6,58.7 R8.2
  Bottom 0.305: Q2.B 95.76,64.19 95.44,63.99 95.07,63.68 95.65,63.24 95.74,63.16 96.02,62.98 T2.3
N$22
  Top 0.305: 133.13,75.86 R13.2 | 133.13,76.69 133.13,76 R13.2 | R13.2 131.53,76.47 131.59,76.75 131.54,76.9 130.19,76.9 Q5.B | R13.2 R11.1
N$23
  Top 0.305: Q1.B 88.35,66.61 88.35,65.5 88.21,65.44 87.86,65.02 86.62,65.02 86,64.4 86,62.6 85.47,61.87 84.26,60.33 | 84.26,60.33 R2.1 R3.2 | T1.3 78.75,67.95 80.1,66.6 80.1,62.4 80.7,61.8 82.79,61.8 84.26,60.33
N$24
  Top 0.305: 91.92,87.03 R16.1 91,88 90.5,88 90,88 R18.2 | 89.13,88.99 R18.2 | R18.2 86.92,91.08 86.86,91 84.79,91 Q6.B
N$26
  Top 0.305: R5.1 111.34,93.6 111.34,91.22 R7.2 111.48,91.08 111.48,89.41 112.32,88.57 T3.2
N$27
  Top 0.305: 109.39,86.47 111.06,86.47 T3.3 111.06,86.33 111.62,85.78 111.62,80.47 Q3.B | 109.39,86.47 108.41,86.47 R9.2 | 109.39,86.47 109.39,91.08 R7.1
N$31
  Top 0.305: 89.13,77.11 R19.2 | 91.92,77.11 R17.1 90.5,77 R19.2 | 88.85,76.97 R19.2 | R19.2 87.01,78.99 87.05,79.09 Q7.B
PYRO_1_PWR  (1 unrouted)
PYRO_1_PWR_RTN  (1 unrouted)
  Route2 0.406: T1.1 86.37,70.83 87.1,70.1 87.1,67.9 Q1.C
PYRO_2_PWR  (via drill 0.51)  (1 unrouted)
  Route15 0.406: v131.19,5.74 132.92,5.74 136.4,9.2 136.4,26 139.9,29.5 141.8,29.5
  Bottom 0.406: v131.19,5.74 131.2,6.63 PO2.1
PYRO_2_PWR_RTN  (via drill 0.51)  (1 unrouted)
  Route2 0.406: 103.43,38.7 101.81,40.32 101.81,50.31 101.91,50.31 102.7,51.2 103.91,51.2 v105.61,53.3
  Route15 0.406: v105.61,53.3 102,56.11 100.63,56.11 99.81,56.83 99.81,60.16 T2.1
  Bottom 0.406: T2.1 98.56,66.46 Q2.C
RESET  (via drill 0.51)
  Route15 0.305: ARD_4.5 66.16,23.01 | v101.62,29.61 100.3,29.2 94.2,29.2 91,26.6 81.4,26.6 77.9,23 66.16,23.01 | 66.16,23.01 56.3,23 ARD_1.3
  Bottom 0.305: v101.62,29.61 107.61,37.3
RX0  (1 unrouted)
  Top 0.305: 15.47,35.9 48.62,35.9 64.14,48.98 ARD_6.8
RX1  (via drill 0.51)
  Route2 0.305: v88.39,30.54 93.47,26.67 100.27,26.67 102.6,24.5 102.56,23.42 102.59,21.08 103.47,20.21
  Bottom 0.305: v88.39,30.54 92,34.86 92,44.08 ARD_5.6
RX3
  Bottom 0.305: ARD_5.2 72.02,49.19 70.41,49.19 67.53,52.3 64.14,52.3 60.15,57.38 42.75,57.42 40.54,57.42 RB1.2
S/A_PWR_IN  (3 unrouted)
  Route15 0.406: 142.2,72.9 138,76.9 130.35,76.9 129.45,76.9 126.38,76.9 SACC.6
  Bottom 0.406: 145.57,65.52 C2_PWR.8
S/A_PWR_OUT  (1 unrouted)
  Top 0.406: 126.99,58.26 126.99,72.4 124.88,74.58 124.06,75.4 124.06,75.43 123.7,75.8 123.7,77.2 SACC.5
S/A_PWR_RTN  (2 unrouted)
SCK
  Bottom 0.305: 66.12,27.94 ARD_4.3 52.4,27.9 38.3,44.8 33.6,44.8 31.5,46.7 ARD_7.5
SCL  (via drill 0.51)
  Top 0.305: LCC.3 106.87,57 104.58,54.7 104.58,39.59 115.95,28.22 115.95,11.04 121.82,6.97 126.99,6.97 134.33,12.12 137.95,14.55 139.4,15.6 CN3.1 | ARD_5.8 88.91,53.59 89.22,53.87 100.1,53.85 100.9,54.7 v101,57.4
  Route2 0.305: B2CC.3 104.35,83.85 105.4,82.8 105.4,69.4 108.8,66 108.8,64.43 104.34,64.19 100.36,64.46 99.64,64.46 99.14,63.96 99.14,63.24 99.64,62.74 100.36,62.74 100.57,62.95 102.84,62.79 103.11,62.57 103.75,62.63 103.94,62.44 104.66,62.44 105.78,62.5 105.78,61.69 106.46,61.01 107.43,61.01 108.8,61.08 108.8,58.95 LCC.3
  Route15 0.305: v101,57.4 106.64,57.4 LCC.3
  Bottom 0.305: SACC.3 125.45,83.68 125.31,83.82 102.68,83.82 B2CC.3 101.27,82.58 99.86,82.58 99.84,82.55 98.43,82.55 B1CC.3 | 106.31,57.14 106.87,57.14 LCC.3
SDA  (1 unrouted)
  Route2 0.305: 141.54,28.68 141.54,24.31 142.25,23.22 142.25,15.49 141.03,14.25 140.31,13.51 139.85,13.06 CN3.2 | 111.9,49.59 107.01,54.48 LCC.4 102,54.56 92.15,54.51 91.6,54.51 90.78,54 87.8,54 86.36,52.56 ARD_5.7 | B2CC.4 102.54,81.44 100.17,83.82 B1CC.4
  Route15 0.305: B2CC.4 102.41,81.31 99.8,78.7 99.8,75.7 102.4,73.1 104.4,73.1 105.2,72.3 105.2,66.8 108.7,63.3 108.7,56.31 LCC.4
  Bottom 0.305: SACC.4 125.45,81.17 118.47,81.17 117.21,82.42 103.66,82.42 102.68,81.44 B2CC.4
SPARE_1_PWR  (2 unrouted)
SPARE_1_PWR_RTN  (1 unrouted)
SPARE_HIGH_1_CONTROL  (via drill 0.51)
  Top 0.305: 100.31,88.57 100.37,88.64 | 100.37,88.64 105.33,93.6 109.25,93.6 R5.2 | v100.17,80.89 100.44,81.17 100.44,88.57 100.37,88.64
  Route2 0.305: v102.4,65.52 102.68,65.8 102.68,66.64 101.14,68.17 100.31,68.17 100.17,68.31 100.17,71.11 100.58,71.53 100.58,73.34 100.44,73.48 100.44,77.39 100.58,77.53 100.58,80.47 v100.17,80.89
  Bottom 0.305: v102.4,65.52 102.4,53.92 104.62,51.91 104.62,48.7 105.75,47.36 105.75,36.46 105.05,35.76 104.5,35.76 103.8,36.46 103.8,36.88 103.1,37.58 103.1,44.84 99.75,48.2 99.19,48.2 ARD_9.2
SPARE_HIGH_1_PWR  (2 unrouted)
SPARE_HIGH_1_PWR_RTN  (1 unrouted)
  Top 0.406: T3.1 113.72,86.47 113.72,80.89 114.14,80.47 Q3.C
  Route2 0.406: 145.57,31.43 C3_CMD.6
SPARE_LOW_1_CONTROL  (via drill 0.51)
  Top 0.305: 92.06,88.99 R16.2
  Top 0.406: R16.2 93,89 93.6,88.4 93.6,74.7 93.59,73.61 92.71,72.61 v91.8,71.7
  Route2 0.406: v91.8,71.7 91.8,66.3 93,65.1 93,60.4 97,56.4 97,56.3 v97.1,56.2
  Route15 0.406: v97.1,56.2 97.1,55.9 101.06,51.94 101.06,47.72 ARD_9.3
TEMP_EXT_1  (via drill 0.51)
  Top 0.305: R22.1 68.03,19 68.03,16.07 R23.2 68.03,15.93 v69.43,14.53
  Route2 0.305: v69.43,14.53 62.31,21.65 62.31,93.46 53.05,102.4 53.05,103.52 53.05,105.23 53.07,105.93 52.47,106.63 52.1,106.7 51.82,106.7 50.77,106.55 49.82,106.55 48.9,107.28 48.9,108.77 47.92,109.94 44.02,109.94 42.76,108.88 42.76,107.11 43.44,106.33 C1_TLM.1
  Bottom 0.305: v69.43,14.53 69.43,10.02 71.11,8.34 ARD_2.8
TEMP_EXT_2  (via drill 0.51)
  Top 0.305: ARD_2.6 66.08,8.95 70.41,11.25 70.41,14.39 71.94,15.93 R25.2 72.08,16.07 72.08,19 R24.1 71.94,19.14 73,19.14 v74.01,17.48
  Route2 0.305: v74.01,17.48 72.39,20 73.09,48.03 73.09,49.72 72.49,50.32 72.49,52.71 64.6,60.6 64.6,83.55 64.91,83.86 64.91,93.19 59.88,98.21 59.49,98.21 58.8,98.9 58.8,102.7 57.7,103.8 55.47,103.8 55.43,103.77 v55.4,103.8
  Bottom 0.305: v55.4,103.8 50.48,103.8 C1_TLM.3
TX0  (1 unrouted)
  Top 0.305: 15.37,38 48.2,38 61.52,48.78 ARD_6.7
TX1  (via drill 0.51)
  Top 0.305: 111.28,30.2 v104.76,36.75
  Bottom 0.305: v104.76,36.75 103.96,37.86 103.96,51.63 101,54.48 82.92,54.48 82.13,53.7 81.28,52.88 ARD_5.5
TX3
  Bottom 0.305: ARD_5.1 69.47,52.98 64.49,52.98 60.12,58.55 39.13,58.45 RB1.3
VIN  (via drill 0.51)  (1 unrouted)
  Top 0.406: R14.2 58.95,14.39 58.95,13.27 48.34,2.65 ARD_1.8 | v109.25,36.32 105.47,40.09 105.47,50.01 106.87,51.41 106.87,51.97 LCC.5
  Route2 0.406: v103.66,3.77 101.98,5.45 98.48,5.45 94.79,1.26 50.57,1.26 49.31,2.52 48.34,2.52 ARD_1.8
  Bottom 0.406: PVIN3.1 129.5,3.62 129.5,6.27 PVIN2.1 129.5,6.55 129.5,9.06 PVIN1.1 129.36,9.2 127.83,9.2 127.41,9.62 127.41,12.52 123.04,12.54 | PVIN7.1 116.37,3.62 116.37,6.27 PVIN6.1 | PVIN5.1 PVIN4.1 123.04,12.54 | 118.23,13.24 116.37,7.39 116.37,6.55 PVIN6.1 | 118.23,13.24 121.84,13.24 123.04,12.54 | v109.25,36.32 109.25,34.28 118.79,24.84 118.79,14.28 118.23,13.24 | v103.66,3.77 114.23,3.77 PVIN6.1
VIN_VOLTAGE_TLM
  Top 0.305: R15.2 61.05,17.88 61.05,14.53 R14.1 61.05,14.39 61.05,10.06 C1.1 61.05,9.92 61.05,2.65 ARD_2.4

### Text on the board
tPlace: B. EXT / HOLE | BATT2 / HOLE | B. EXT / HOLE | BATT2 / HOLE | RB / HOLE | BATT1 / HOLE | BATT2 / HOLE | RB / HOLE | ARD / HOLD | ARD / HOLD | ARD / HOLD | ARD / HOLD | GYRO HOLE | GYRO HOLE | ARD / HOLD
tNames: AlphaNewt v1.0 / ASTRONEWTS LLC | EXTERNAL BATTERY | ROCKBLOCK | Battery 2 / Current Sense | Solar Array / Current Sense | Battery 1 / Current Sense | USB-A | LOAD / Current Sense | SD BOARD | ALTIMETER | Flight Temp Sensor | GPS BOARD
bNames: BATTERY 1 | BATTERY 2 | GYRO | VIN | B_EXT | ARDUINO | VIN | B_EXT | VIN | B_EXT | P1 | GYRO BOARD | P6 | P4 | P2 | P7 | P5 | P3